# EAGLE design n2k-breakout-7.0-ISO (EAGLE 9.6.2)

## Sheet 1 of 5
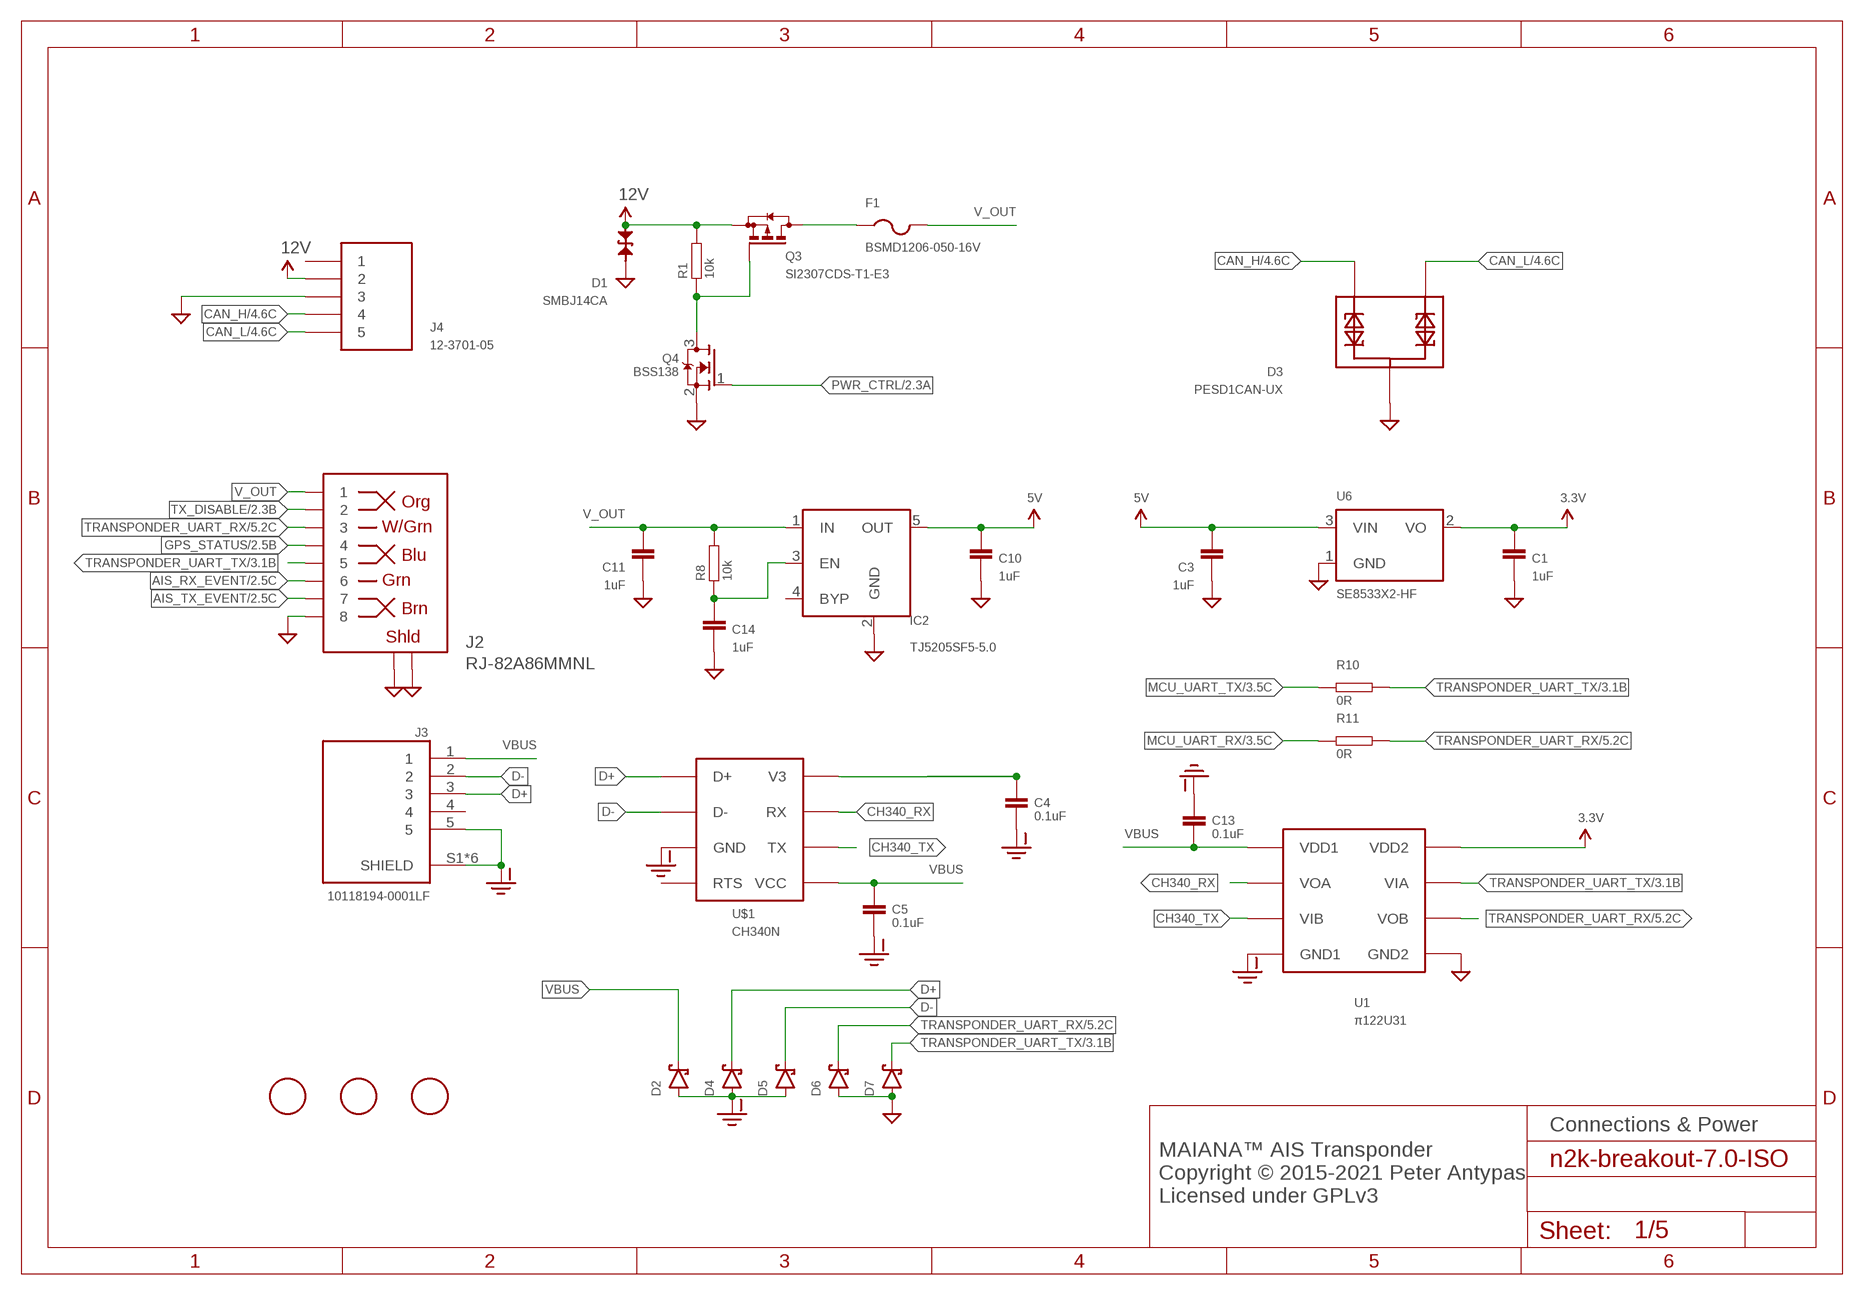
[diagram p0: schematic, sheet 1]

### Parts
C1  1uF  CAPACITOR0603  [0603]
C3  1uF  CAPACITOR0603  [0603]
C4  0.1uF  CAPACITOR0603  [0603]
C5  0.1uF  CAPACITOR0603  [0603]
C10  1uF  CAPACITOR0603  [0603]
C11  1uF  CAPACITOR0603  [0603]
C13  0.1uF  CAPACITOR0603  [0603]
C14  1uF  CAPACITOR0603  [0603]
D1  SMBJ14CA  DIODE-TVS-BIDIRSMB  [SMB-BIDIR]
D2  DIODE-SCHOTTKYSOD323  [SOD323]
D3  PESD1CAN-UX  [SOT65P210X110-3N]
D4  DIODE-SCHOTTKYSOD323  [SOD323]
D5  DIODE-SCHOTTKYSOD323  [SOD323]
D6  DIODE-SCHOTTKYSOD323  [SOD323]
D7  DIODE-SCHOTTKYSOD323  [SOD323]
F1  BSMD1206-050-16V  PTCFUSE-1206  [R1206]
IC2  TJ5205SF5-5.0  MIC5219XX  [SOT23-5]
J2  RJ-82A86MMNL  [RJ-82A86MMNL]
J3  10118194-0001LF  [AMPHENOL_10118194-0001LF]
J4  12-3701-05  [MICRO_C_5PIN]
Q3  SI2307CDS-T1-E3  BSS84  [SOT23]
Q4  BSS138  MOSFET-NREFLOW  [SOT23]
R1  10k  RESISTOR0603  [0603]
R8  10k  RESISTOR0603  [0603]
R10  0R  RESISTOR0603  [0603]
R11  0R  RESISTOR0603  [0603]
U1  π122U31  PI122U3X  [SOIC8]
U6  SE8533X2-HF  MCP1799T  [SOT23]
U$1  CH340N  CH330N  [SOIC-8]
U$2  FIDUCIAL  [FIDUCIAL_1MM]
U$3  FIDUCIAL  [FIDUCIAL_1MM]
U$4  FIDUCIAL  [FIDUCIAL_1MM]

### Nets
3.3V: C1.P$1 U1.8(VDD2) U6.2(VO) ; also sheet 2,3,4,5
5V: C3.P$1 C10.P$1 IC2.5(OUT) U6.3(VIN) ; also sheet 4,5
12V: D1.A J4.2 Q3.2(S) R1.P$2 ; also sheet 2,5
AIS_RX_EVENT: J2.P$6 ; also sheet 2
AIS_TX_EVENT: J2.P$7 ; also sheet 2
CAN_H: D3.2 J4.4 ; also sheet 4,5
CAN_L: D3.1 J4.5 ; also sheet 4,5
CH340_RX: U1.2(VOA) U$1.7(RX)
CH340_TX: U1.3(VIB) U$1.6(TX)
D+: D4.C J3.3 U$1.1(D+)
D-: D5.C J3.2 U$1.2(D-)
GND: C1.P$2 C3.P$2 C10.P$2 C11.P$2 C14.P$2 D1.C D3.3 D6.A D7.A IC2.2(GND) J2.P$8 J2.P$9(SHLD) J2.P$10(SHLD) J2.P$11(SHLD) J2.P$12(SHLD) J4.3 Q4.2(S) U1.5(GND2) U6.1(GND) ; also sheet 2,3,4,5
GND-ISO: C4.P$2 C5.P$2 C13.P$1 D2.A D4.A D5.A J3.5 J3.S1(SHIELD) J3.S2(SHIELD) J3.S3(SHIELD) J3.S4(SHIELD) J3.S5(SHIELD) J3.S6(SHIELD) U1.4(GND1) U$1.3(GND)
GPS_STATUS: J2.P$4 ; also sheet 2
MCU_UART_RX: R11.P$1 ; also sheet 3
MCU_UART_TX: R10.P$1 ; also sheet 3
N$1: C4.P$1 U$1.8(V3)
N$8: Q3.1(G) Q4.3(D) R1.P$1
N$10: F1.1 Q3.3(D)
N$12: C14.P$1 IC2.3(EN) R8.P$1
PWR_CTRL: Q4.1(G) ; also sheet 2
TRANSPONDER_UART_RX: D6.C J2.P$3 R11.P$2 U1.6(VOB) ; also sheet 5
TRANSPONDER_UART_TX: D7.C J2.P$5 R10.P$2 U1.7(VIA) ; also sheet 3,5
TX_DISABLE: J2.P$2 ; also sheet 2,3
V_OUT: C11.P$1 F1.2 IC2.1(IN) J2.P$1 R8.P$2
VBUS: C5.P$1 C13.P$2 D2.C J3.1 U1.1(VDD1) U$1.5(VCC)
Unconnected: IC2.4(BYP) J3.4 J4.1 U$1.4(RTS)

### Notes on the sheet
- Connections & Power
- MAIANA™ AIS Transponder
  Copyright © 2015-2021 Peter Antypas
  Licensed under GPLv3

## Sheet 2 of 5
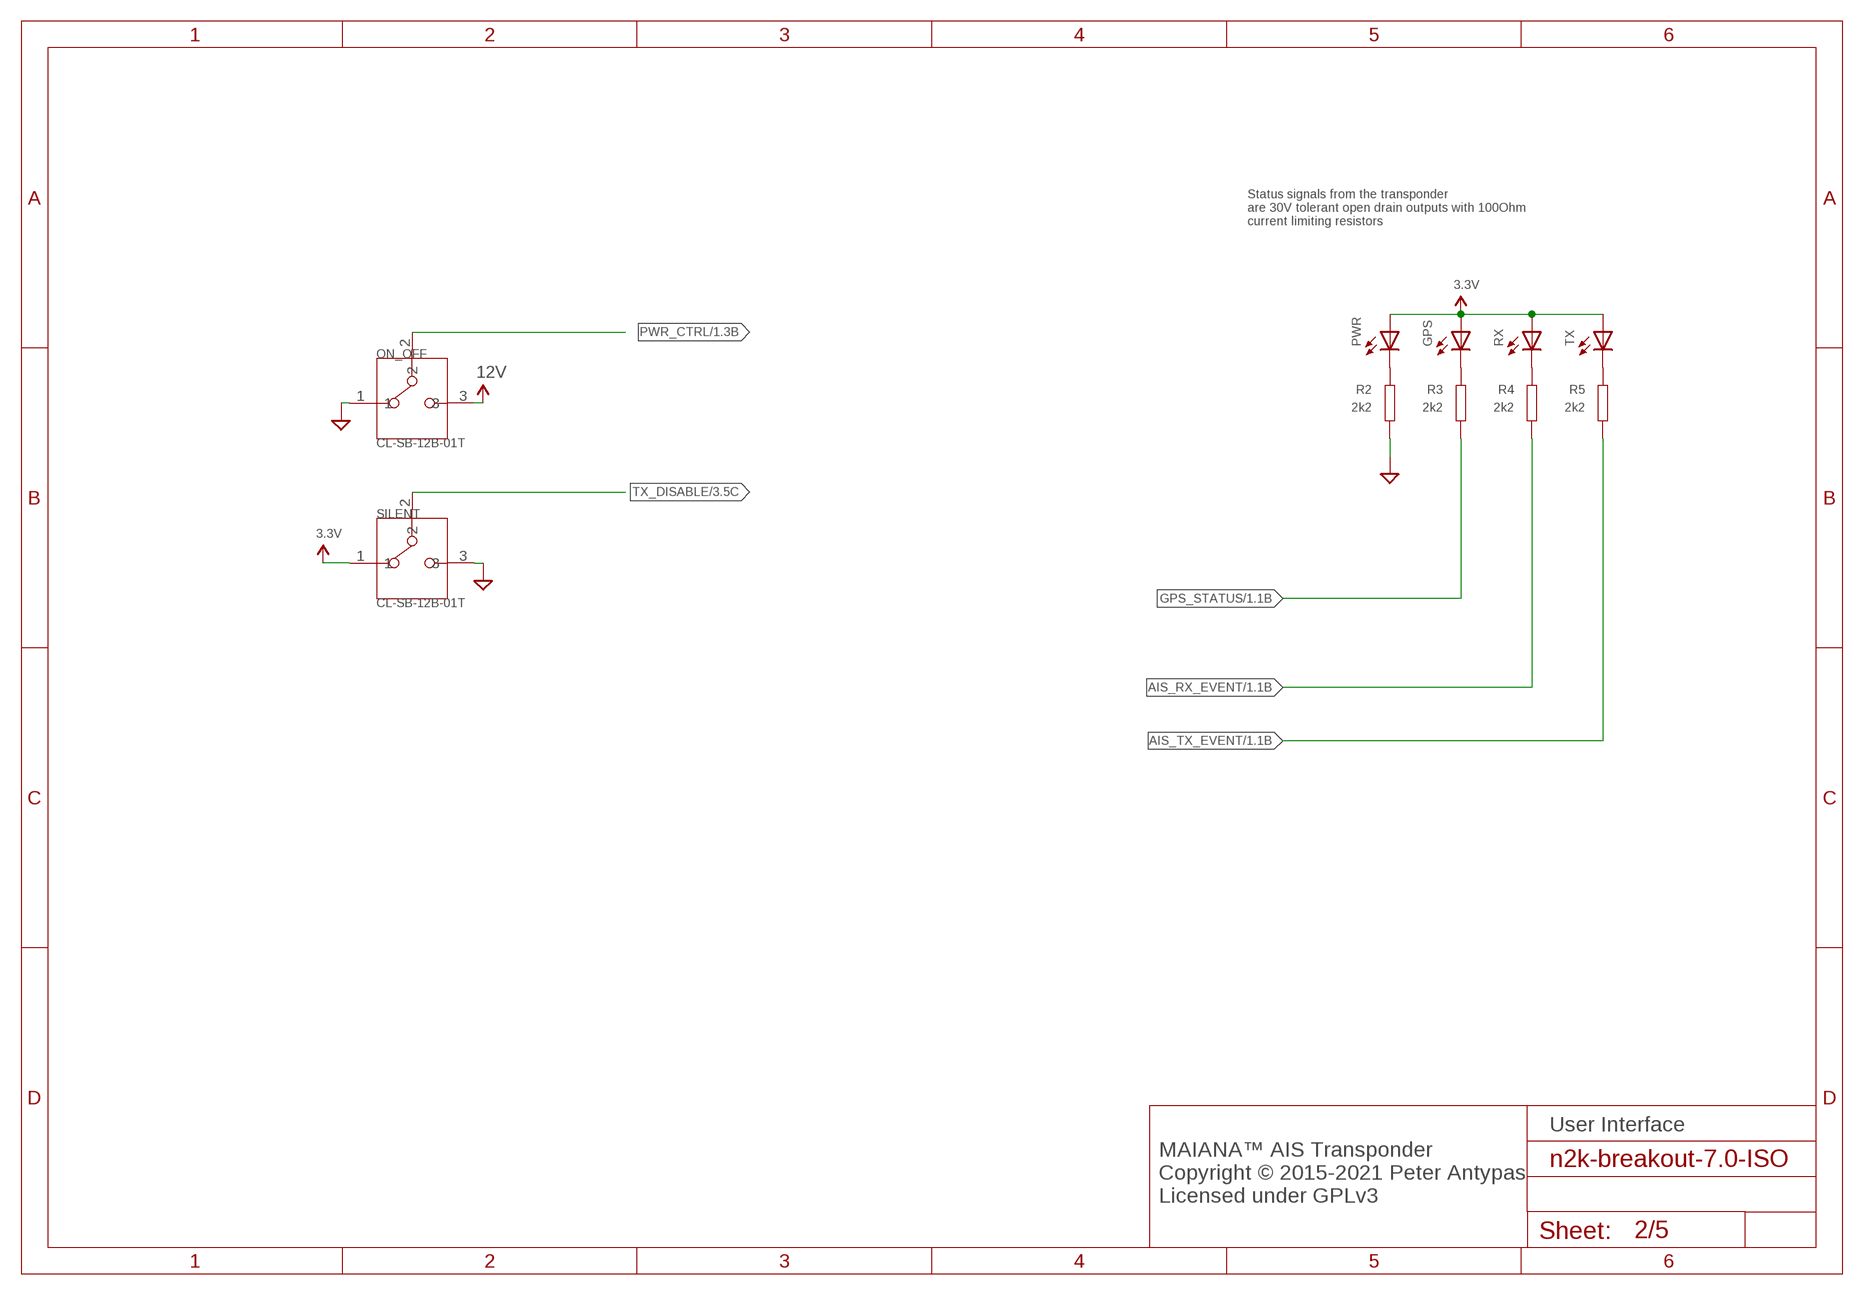
[diagram p1: schematic, sheet 2]

### Parts
GPS  LEDCHIPLED_1206  [CHIPLED_1206]
ON_OFF  CL-SB-12B-01T  [CL-SB-12B]
PWR  LEDCHIPLED_1206  [CHIPLED_1206]
R2  2k2  RESISTOR0603  [0603]
R3  2k2  RESISTOR0603  [0603]
R4  2k2  RESISTOR0603  [0603]
R5  2k2  RESISTOR0603  [0603]
RX  LEDCHIPLED_1206  [CHIPLED_1206]
SILENT  CL-SB-12B-01T  [CL-SB-12B]
TX  LEDCHIPLED_1206  [CHIPLED_1206]

### Nets
3.3V: GPS.A PWR.A RX.A SILENT.1 TX.A ; also sheet 1,3,4,5
12V: ON_OFF.3 ; also sheet 1,5
AIS_RX_EVENT: R4.P$2 ; also sheet 1
AIS_TX_EVENT: R5.P$2 ; also sheet 1
GND: ON_OFF.1 R2.P$2 SILENT.3 ; also sheet 1,3,4,5
GPS_STATUS: R3.P$2 ; also sheet 1
N$2: PWR.C R2.P$1
N$3: GPS.C R3.P$1
N$4: R4.P$1 RX.C
N$6: R5.P$1 TX.C
PWR_CTRL: ON_OFF.2 ; also sheet 1
TX_DISABLE: SILENT.2 ; also sheet 1,3

### Notes on the sheet
- Status signals from the transponder
  are 30V tolerant open drain outputs with 100Ohm 
  current limiting resistors
- User Interface
- MAIANA™ AIS Transponder
  Copyright © 2015-2021 Peter Antypas
  Licensed under GPLv3

## Sheet 3 of 5
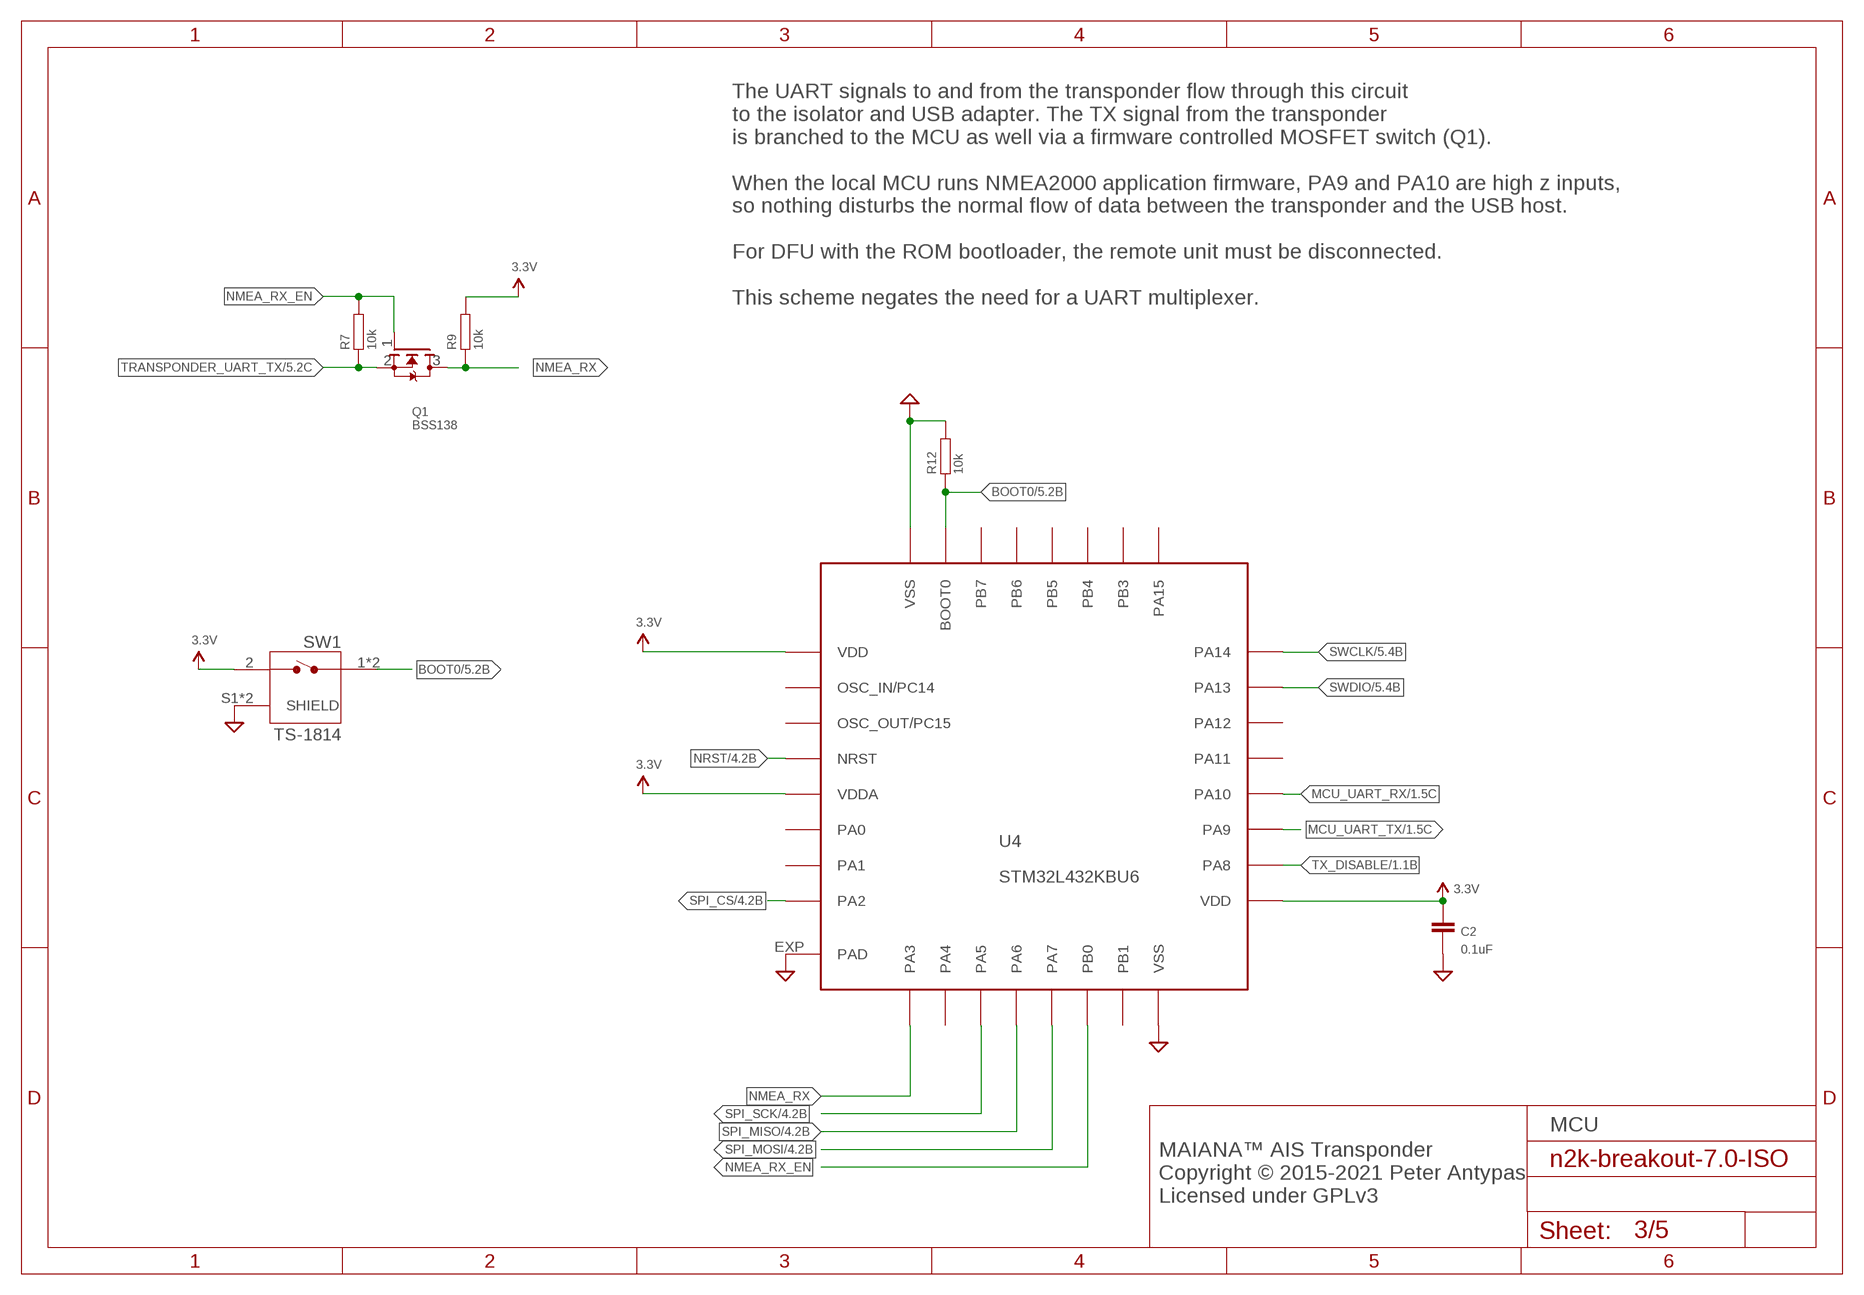
[diagram p2: schematic, sheet 3]

### Parts
C2  0.1uF  CAPACITOR0603  [0603]
Q1  BSS138  MOSFET-NREFLOW  [SOT23]
R7  10k  RESISTOR0603  [0603]
R9  10k  RESISTOR0603  [0603]
R12  10k  RESISTOR0603  [0603]
SW1  TS-1814  1977066-1  [TE_1977066-1]
U4  STM32L432KBU6  STM32L432KXXX  [QFN32]

### Nets
3.3V: C2.P$1 R9.P$2 SW1.2 U4.1(VDD) U4.5(VDDA) U4.17(VDD) ; also sheet 1,2,4,5
BOOT0: R12.P$1 SW1.1 SW1.3 U4.31(BOOT0) ; also sheet 5
GND: C2.P$2 R12.P$2 SW1.S1(SHIELD) SW1.S2(SHIELD) U4.16(VSS) U4.32(VSS) U4.EXP(PAD) ; also sheet 1,2,4,5
MCU_UART_RX: U4.20(PA10) ; also sheet 1
MCU_UART_TX: U4.19(PA9) ; also sheet 1
NMEA_RX: Q1.3(D) R9.P$1 U4.9(PA3)
NMEA_RX_EN: Q1.1(G) R7.P$2 U4.14(PB0)
NRST: U4.4(NRST) ; also sheet 4,5
SPI_CS: U4.8(PA2) ; also sheet 4
SPI_MISO: U4.12(PA6) ; also sheet 4
SPI_MOSI: U4.13(PA7) ; also sheet 4
SPI_SCK: U4.11(PA5) ; also sheet 4
SWCLK: U4.24(PA14) ; also sheet 5
SWDIO: U4.23(PA13) ; also sheet 5
TRANSPONDER_UART_TX: Q1.2(S) R7.P$1 ; also sheet 1,5
TX_DISABLE: U4.18(PA8) ; also sheet 1,2
Unconnected: U4.2(OSC_IN/PC14) U4.3(OSC_OUT/PC15) U4.6(PA0) U4.7(PA1) U4.10(PA4) U4.15(PB1) U4.21(PA11) U4.22(PA12) U4.25(PA15) U4.26(PB3) U4.27(PB4) U4.28(PB5) U4.29(PB6) U4.30(PB7)

### Notes on the sheet
- The UART signals to and from the transponder flow through this circuit
  to the isolator and USB adapter. The TX signal from the transponder
  is branched to the MCU as well via a firmware controlled MOSFET switch (Q1).
  
  When the local MCU runs NMEA2000 application firmware, PA9 and PA10 are high z inputs,
  so nothing disturbs the normal flow of data between the transponder and the USB host.
  
  For DFU with the ROM bootloader, the remote unit must be disconnected.
  
  This scheme negates the need for a UART multiplexer.
- MCU
- MAIANA™ AIS Transponder
  Copyright © 2015-2021 Peter Antypas
  Licensed under GPLv3

## Sheet 4 of 5
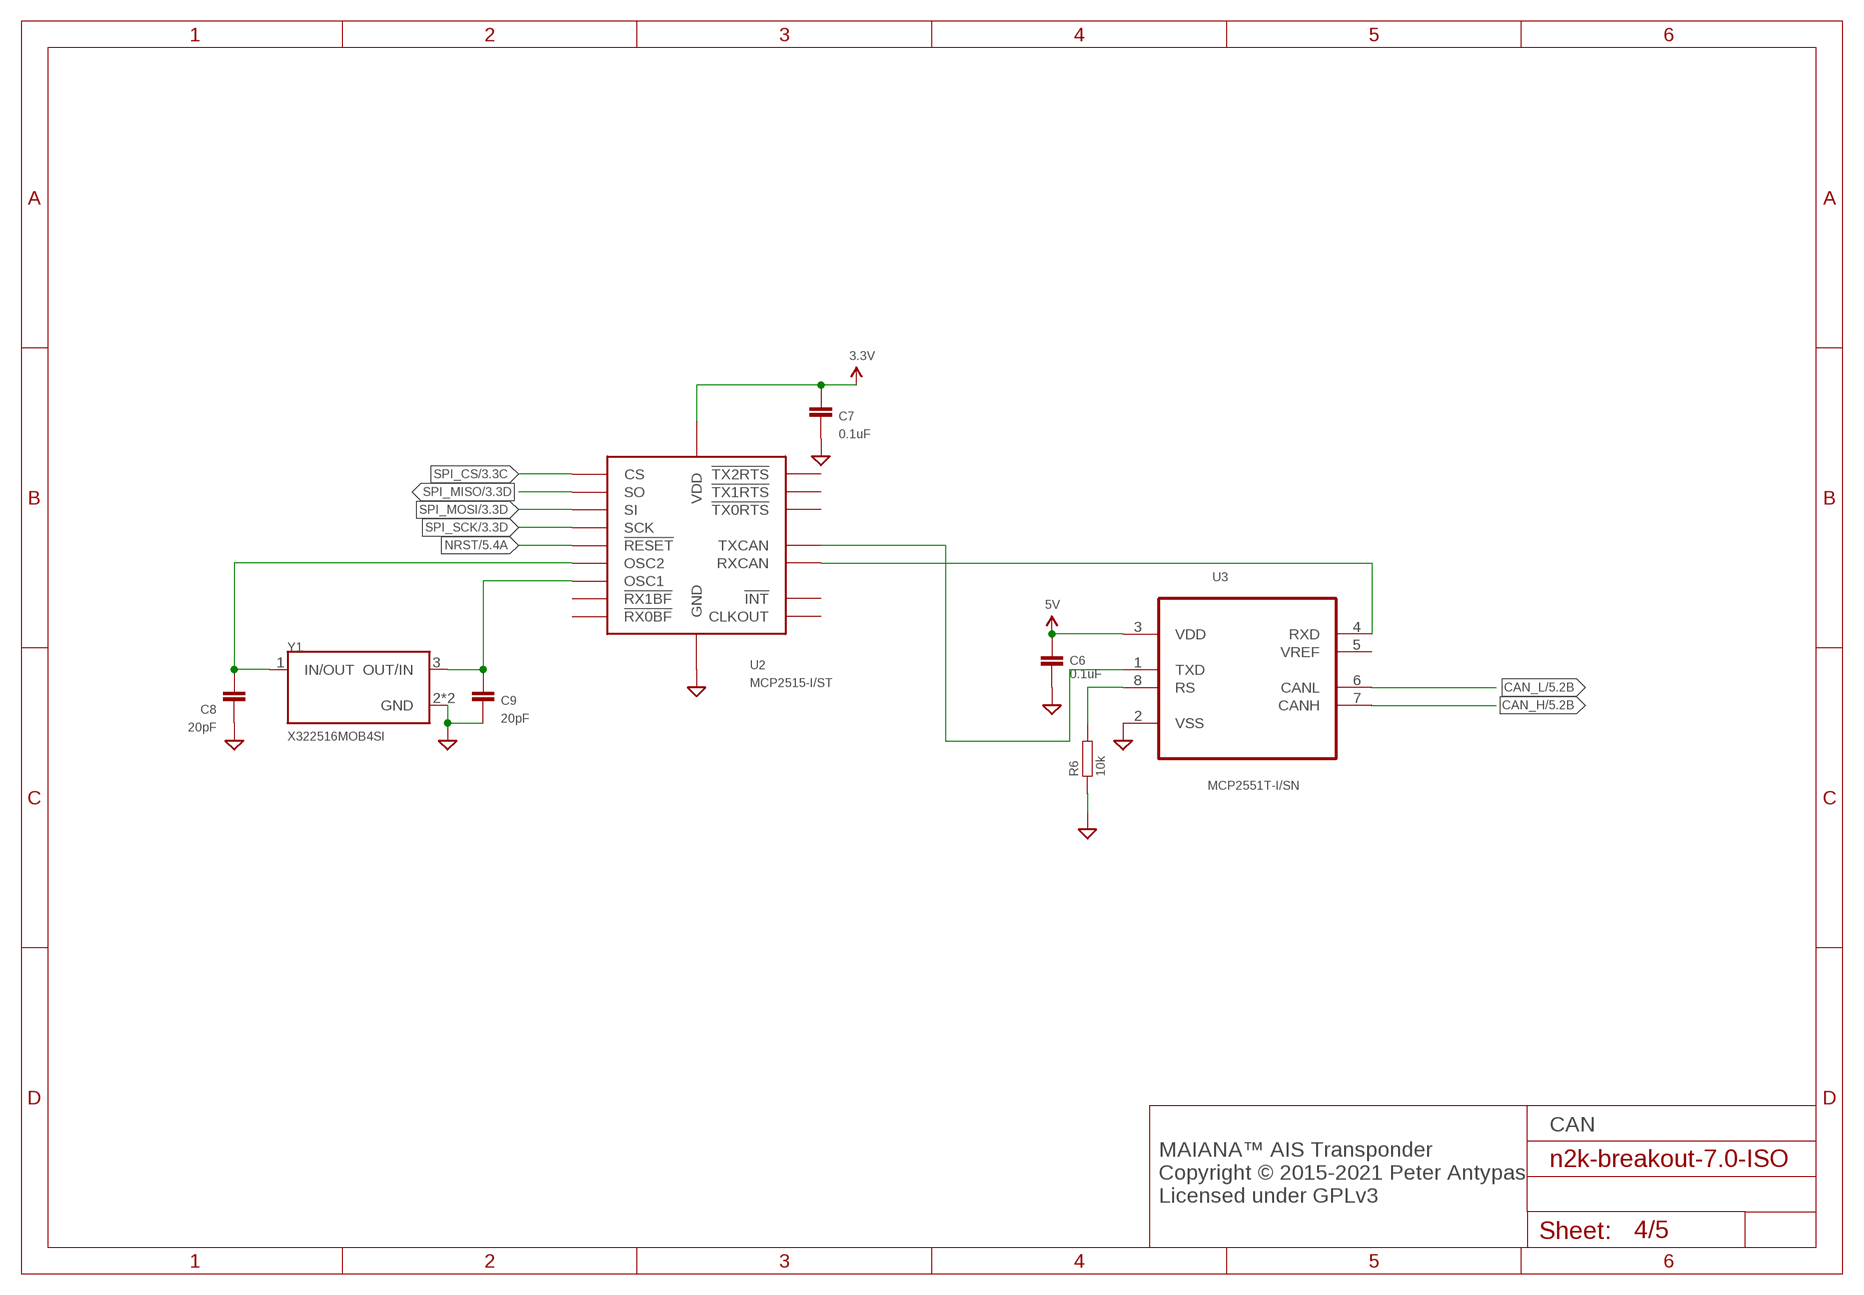
[diagram p3: schematic, sheet 4]

### Parts
C6  0.1uF  CAPACITOR0603  [0603]
C7  0.1uF  CAPACITOR0603  [0603]
C8  20pF  CAPACITOR0603  [0603]
C9  20pF  CAPACITOR0603  [0603]
R6  10k  RESISTOR0603  [0603]
U2  MCP2515-I/ST  MCP2515TSSOP20  [TSSOP20]
U3  MCP2551T-I/SN  [SOIC127P600X175-8N]
Y1  X322516MOB4SI  ECS-300-8-36CKM-TR  [XTAL_ECS-160-10-36-JGN-TR]

### Nets
3.3V: C7.P$1 U2.20(VDD) ; also sheet 1,2,3,5
5V: C6.P$1 U3.3(VDD) ; also sheet 1,5
CAN_H: U3.7(CANH) ; also sheet 1,5
CAN_L: U3.6(CANL) ; also sheet 1,5
GND: C6.P$2 C7.P$2 C8.P$2 C9.P$2 R6.P$1 U2.10(GND) U3.2(VSS) Y1.2(GND) Y1.4(GND) ; also sheet 1,2,3,5
N$5: R6.P$2 U3.8(RS)
N$7: U2.2(RXCAN) U3.4(RXD)
N$11: U2.1(TXCAN) U3.1(TXD)
N$14: C9.P$1 U2.9(OSC1) Y1.3(OUT/IN)
N$16: C8.P$1 U2.8(OSC2) Y1.1(IN/OUT)
NRST: U2.19(!RESET) ; also sheet 3,5
SPI_CS: U2.18(CS) ; also sheet 3
SPI_MISO: U2.17(SO) ; also sheet 3
SPI_MOSI: U2.16(SI) ; also sheet 3
SPI_SCK: U2.14(SCK) ; also sheet 3
Unconnected: U2.3(CLKOUT) U2.4(!TX0RTS) U2.5(!TX1RTS) U2.7(!TX2RTS) U2.11(!RX1BF) U2.12(!RX0BF) U2.13(!INT) U3.5(VREF)

### Notes on the sheet
- CAN
- MAIANA™ AIS Transponder
  Copyright © 2015-2021 Peter Antypas
  Licensed under GPLv3

## Sheet 5 of 5
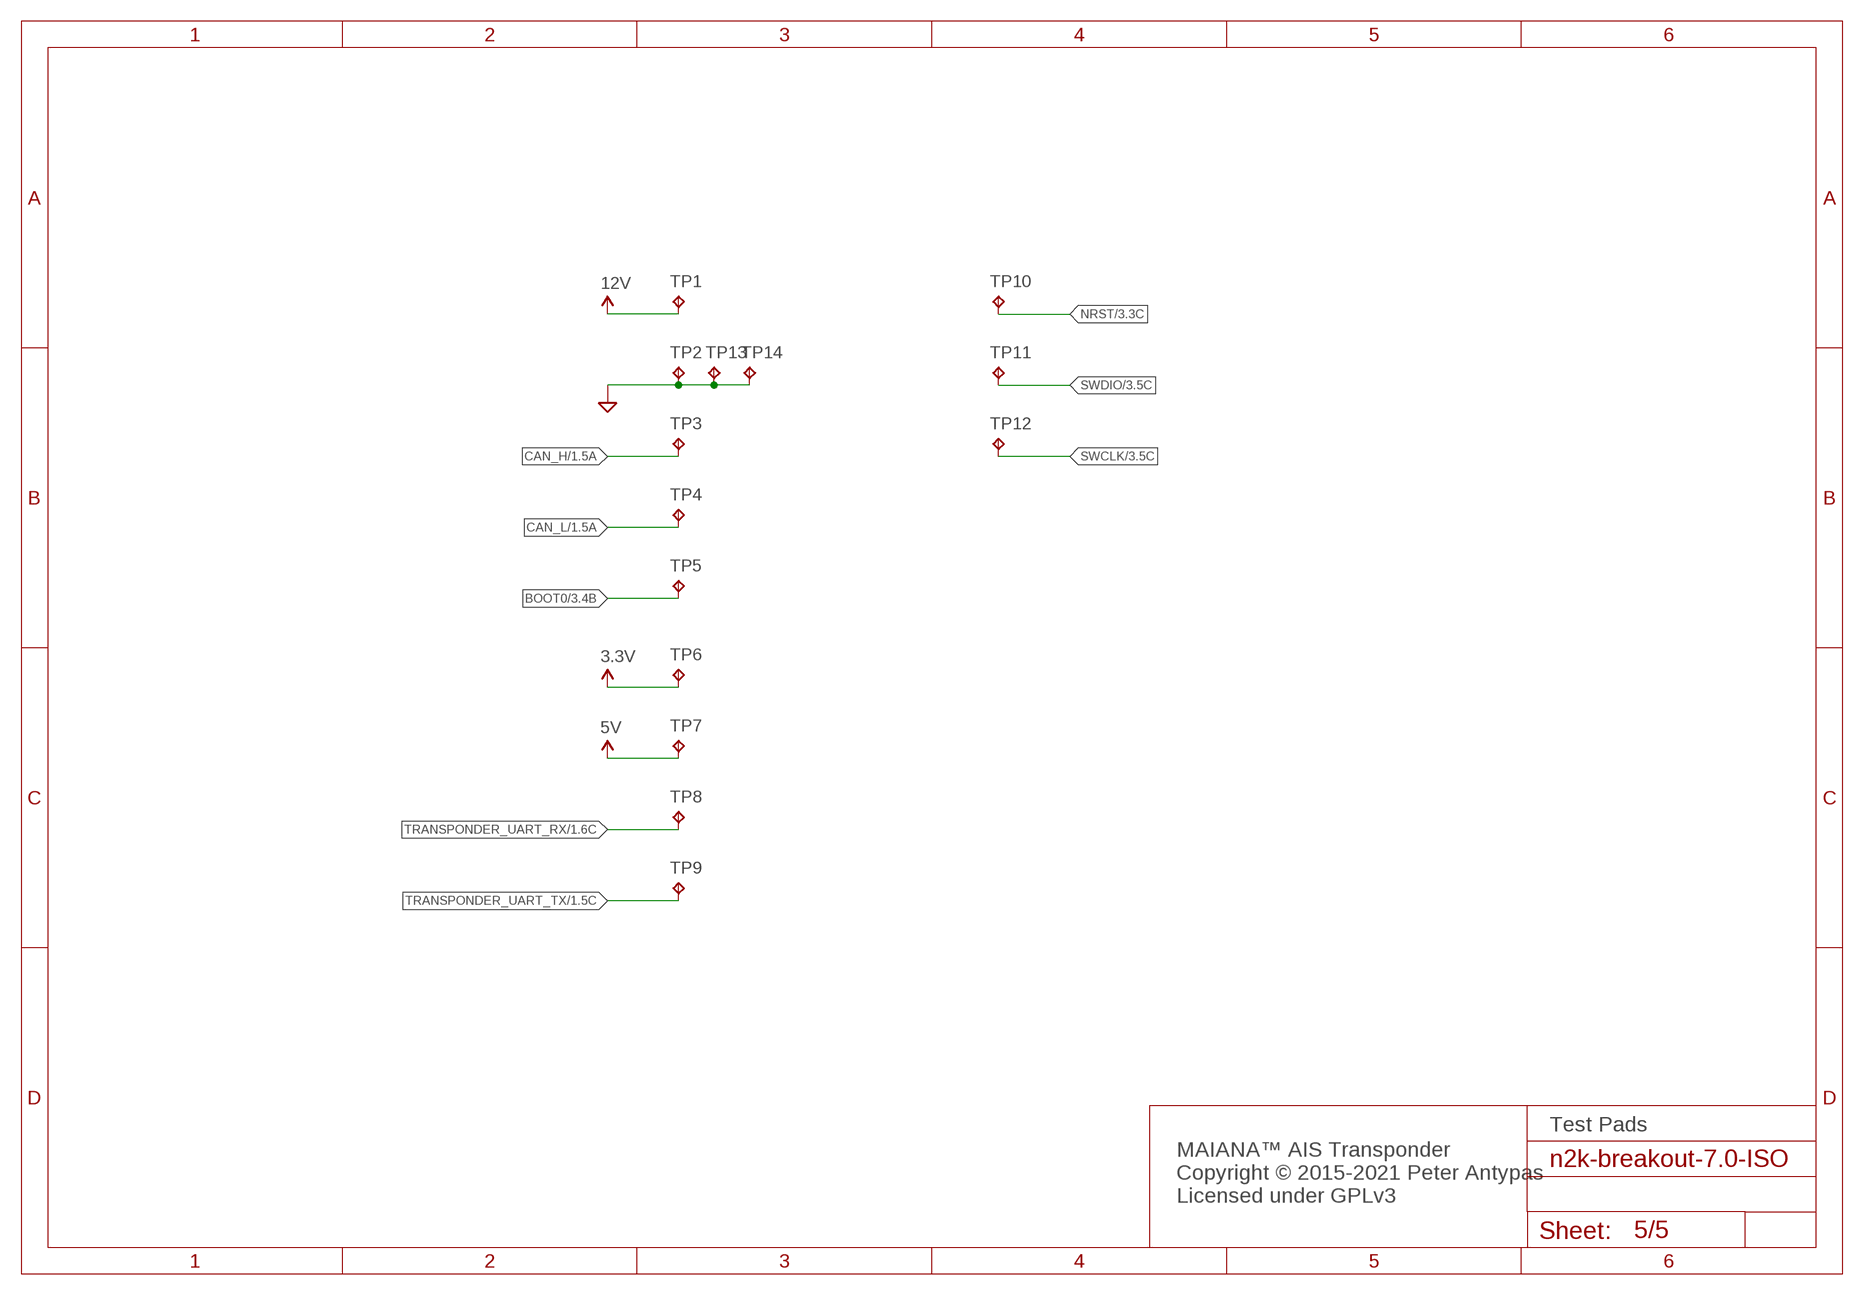
[diagram p4: schematic, sheet 5]

### Parts
TP1  TPTP12R  [TP12R]
TP2  TPTP12R  [TP12R]
TP3  TPTP12R  [TP12R]
TP4  TPTP12R  [TP12R]
TP5  TPTP12R  [TP12R]
TP6  TPTP12R  [TP12R]
TP7  TPTP12R  [TP12R]
TP8  TPTP12R  [TP12R]
TP9  TPTP12R  [TP12R]
TP10  TPTP12R  [TP12R]
TP11  TPTP12R  [TP12R]
TP12  TPTP12R  [TP12R]
TP13  TPTP12R  [TP12R]
TP14  TPTP12R  [TP12R]

### Nets
3.3V: TP6.TP ; also sheet 1,2,3,4
5V: TP7.TP ; also sheet 1,4
12V: TP1.TP ; also sheet 1,2
BOOT0: TP5.TP ; also sheet 3
CAN_H: TP3.TP ; also sheet 1,4
CAN_L: TP4.TP ; also sheet 1,4
GND: TP2.TP TP13.TP TP14.TP ; also sheet 1,2,3,4
NRST: TP10.TP ; also sheet 3,4
SWCLK: TP12.TP ; also sheet 3
SWDIO: TP11.TP ; also sheet 3
TRANSPONDER_UART_RX: TP8.TP ; also sheet 1
TRANSPONDER_UART_TX: TP9.TP ; also sheet 1,3

### Notes on the sheet
- Test Pads
- MAIANA™ AIS Transponder
  Copyright © 2015-2021 Peter Antypas
  Licensed under GPLv3

## Library data of the parts
C1 C3 C10 C11 C14 = MyPassives:CAPACITOR: Standard SMD capacitor; PARTNO: CC0603KRX5R8BB105
C2 C4-C7 C13 = MyPassives:CAPACITOR: Standard SMD capacitor; PARTNO: 06035C104KAT2A
C8 C9 = MyPassives:CAPACITOR: Standard SMD capacitor; PARTNO: GRM1885C1H200JA01D
D1 = MyDiodes:DIODE-TVS-BIDIR: Bidirectional TVS diode; PARTNO: SMBJ14CA
D2 D4-D7 = MyDiodes:DIODE-SCHOTTKY: Standard SMD Schottky diode
D3 = PESD1CAN-UX:PESD1CAN-UX: Bidirectional TVS Diode for CAN bus; PARTNO: PESD1CAN-UX
F1 = adafruit:PTCFUSE: PTC fuses, resettable thermistors; PARTNO: BSMD1206-050-16V
GPS PWR RX TX = led:LED: LED OSRAM: - CHIPLED LG R971, LG N971, LY N971, LG Q971, LY Q971, LO R971, LY R971 LH N974, LH R974 LS Q976, LO Q976, LY Q976 LO Q996 - Hyper CHIPLED LW Q18S LB Q993, LB Q99A, LB R99A - SideLED LS A670, LO A670, LY A670, LG A670, LP A670 LB A673, LV A673, LT A673, LW A673 LH A674 LY A675 LS A676, LA A676, LO A676, LY A676, LW A676 LS A679, LY A679, LG A679 - Hyper Micro SIDELED® LS Y876, LA Y876, LO Y876, LY Y876 LT Y87S - SmartLED LW L88C, LW L88S LB L89C, LB L89S, LG L890 LS L89K, LO L89K, LY L89K LS L896, LA L896, LO L896, LY L896 - TOPLED LS T670, LO T670, LY T670, LG T670, LP T670 LSG T670, LSP T670, LSY T670, LOP T670, LYG T670 LG T671, LOG T671, LSG T671 LB T673, LV T673, LT T673, LW T673 LH T674 LS T676, LA T676, LO T676, LY T676, LB T676, LH T676, LSB T676, LW T676 LB T67C, LV T67C, LT T67C, LS T67K, LO T67K, LY T67K, LW E67C LS E67B, LA E67B, LO E67B, LY E67B, LB E67C, LV E67C, LT E67C LW T67C LS T679, LY T679, LG T679 LS T770, LO T770, LY T770, LG T770, LP T770 LB T773, LV T773, LT T773, LW T773 LH T774 LS E675, LA E675, LY E675, LS T675 LS T776, LA T776, LO T776, LY T776, LB T776 LHGB T686 LT T68C, LB T68C - Hyper Mini TOPLED® LB M676 - Mini TOPLED Santana® LG M470 LS M47K, LO M47K, LY M47K Source: http://www.osram.convergy.de LUXEON: - LUMILED® LXK2-PW12-R00, LXK2-PW12-S00, LXK2-PW14-U00, LXK2-PW14-V00 LXK2-PM12-R00, LXK2-PM12-S00, LXK2-PM14-U00 LXK2-PE12-Q00, LXK2-PE12-R00, LXK2-PE12-S00, LXK2-PE14-T00, LXK2-PE14-U00 LXK2-PB12-K00, LXK2-PB12-L00, LXK2-PB12-M00, LXK2-PB14-N00, LXK2-PB14-P00, LXK2-PB14-Q00 LXK2-PR12-L00, LXK2-PR12-M00, LXK2-PR14-Q00, LXK2-PR14-R00 LXK2-PD12-Q00, LXK2-PD12-R00, LXK2-PD12-S00 LXK2-PH12-R00, LXK2-PH12-S00 LXK2-PL12-P00, LXK2-PL12-Q00, LXK2-PL12-R00 Source: www.luxeon.com KINGBRIGHT: KA-3528ASYC Source: www.kingbright.com; PARTNO: TJ-S3216CL9T5ALC2G-A5
IC2 = v-reg-micrel:MIC5219XX: VOLTAGE REGULATOR; OC_FARNELL: unknown; OC_NEWARK: unknown; PARTNO: TJ5205SF5-5.0
J2 = xyfw:RJ-82A86MMNL: Mid-mount RJ45 jack; PARTNO: RJ-82A86MMNL
J3 = 10118194-0001LF:10118194-0001LF: Micro Usb, 2.0 Type b, Rcpt, Smt Check prices <https://snapeda.com/parts/10118194-0001LF/Amphenol%20ICC%20%28FCI%29/view-part/?ref=eda>; ARROW_ELECTRONICS-PURCHASE-URL: https://snapeda.com/shop?store=Arrow+Electronics&id=4816633; AVAILABILITY: Good; DESCRIPTION: USB - micro B USB 2.0 Receptacle Connector 5 Position Surface Mount, Right Angle; Through Hole; DIGIKEY-PURCHASE-URL: https://snapeda.com/shop?store=DigiKey&id=4816633; MF: Amphenol ICC (FCI); MOUSER-PURCHASE-URL: https://snapeda.com/shop?store=Mouser&id=4816633; MP: 10118194-0001LF; PACKAGE: None; PARTNO: 10118194-0001LF; PRICE: None
J4 = Hysik:12-3701-05: Micro-C NMEA 2000 connector, 5pin, male, 90deg PCB mount; PARTNO: 12-3701-05
ON_OFF SILENT = CL-SB-12B-01T:CL-SB-12B-01T: Check prices <https://pricing.snapeda.com/parts/CL-SB-12B-01T/Nidec%20Copal/view-part?ref=eda>; AVAILABILITY: In Stock; DESCRIPTION: Slide Switch SPDT Surface Mount; MF: Nidec Copal; MP: CL-SB-12B-01T; PACKAGE: None; PARTNO: CL-SB-12B-01T; PRICE: None
Q1 Q4 = adafruit:MOSFET-N: N-Channel Mosfet 2N7002E - 60V 260mA SOT23 [Digikey: 2N7002ET1GOSTR-ND] - REEL BSH103 - 30V 850mA SOT23 [Digikey: 568-5013-1-ND]; PARTNO: BSS138
Q3 = transistor-small-signal:BSS84: P-CHANNEL MOS FET; PARTNO: SI2307CDS-T1-E3
R1 R6-R9 R12 = MyPassives:RESISTOR: Standard SMD resistor; PARTNO: RC0603FR-0710KL
R2-R5 = MyPassives:RESISTOR: Standard SMD resistor; PARTNO: CR0603-FX-2201ELF
R10 R11 = MyPassives:RESISTOR: Standard SMD resistor
SW1 = 1977066-1:1977066-1: FSMMSHP=R/A TACT SWITCH, SMT W/L Check prices <https://pricing.snapeda.com/parts/1977066-1/TE%20Connectivity/view-part?ref=eda>; AVAILABILITY: Not in stock; COMMENT: 1977066-1; DESCRIPTION: Switch Tactile OFF (ON) SPST Round Button Gull Wing 0.05A 12VDC 100000Cycles 1.57N SMD T/R; MF: TE Connectivity; MP: 1977066-1; PACKAGE: None; PARTNO: TS-1814; PRICE: None; PURCHASE-URL: https://pricing.snapeda.com/search/part/1977066-1/?ref=eda
TP1-TP14 = testpad:TP: Test pad
U1 = 2paisemi:PI122U3X: 2 Channel Capacitive Divider Isolator; PARTNO: π122U31
U2 = mcp2515:MCP2515: CAN Bus Controller with SPI interface; PARTNO: MCP2515-I/ST
U3 = MCP2551T-I_SN:MCP2551T-I/SN: High-Speed CAN Transceiver Check prices <https://pricing.snapeda.com/parts/MCP2551T-I/SN/Microchip/view-part?ref=eda>; AVAILABILITY: In Stock; DESCRIPTION: 1/1 Transceiver Half CANbus 8-SOIC; MF: Microchip; MP: MCP2551T-I/SN; PACKAGE: SO-8 Microchip; PARTNO: MCP2551T-I/SN; PRICE: None; PURCHASE-URL: https://pricing.snapeda.com/search/part/MCP2551T-I/SN/?ref=eda
U4 = stm32:STM32L432KXXX; PARTNO: STM32L422KBU6
U6 = microchip:MCP1799T: 80mA High Voltage Automotive LDO; PARTNO: SE8533X2-HF; VALUE: MCP1799T
U$1 = JiangsuQinHeng:CH330N: USB to UART bridge; PARTNO: CH340N
U$2-U$4 = adafruit:FIDUCIAL: For use by pick and place machines to calibrate the vision/machine, 1mm By microbuilder.eu
Y1 = ECS-300-8-36CKM-TR:ECS-300-8-36CKM-TR: The minature ECS-160-10-36-JGN-TR is a compact SMD Crystal. The industry standard 2.5 x 2.0 x 0.55 mm ceramic package is ideal for today’s SMD manufacturing environment. Buy Part <https://snapeda.com/parts/ECS-300-8-36CKM-TR/ECS%20Inc./view-part/?ref=eda>; ARROW_ELECTRONICS-PURCHASE-URL: https://snapeda.com/shop?store=Arrow+Electronics&id=576184; AVAILABILITY: Good; DESCRIPTION: 30MHz ±10ppm Crystal 8pF 50 Ohms 4-SMD, No Lead; DIGIKEY-PURCHASE-URL: https://snapeda.com/shop?store=DigiKey&id=576184; MF: ECS Inc.; MOUSER-PURCHASE-URL: https://snapeda.com/shop?store=Mouser&id=576184; MP: ECS-300-8-36CKM-TR; PACKAGE: SMD-4 ECS International; PARTNO: X322516MOB4SI; PRICE: None

## Board
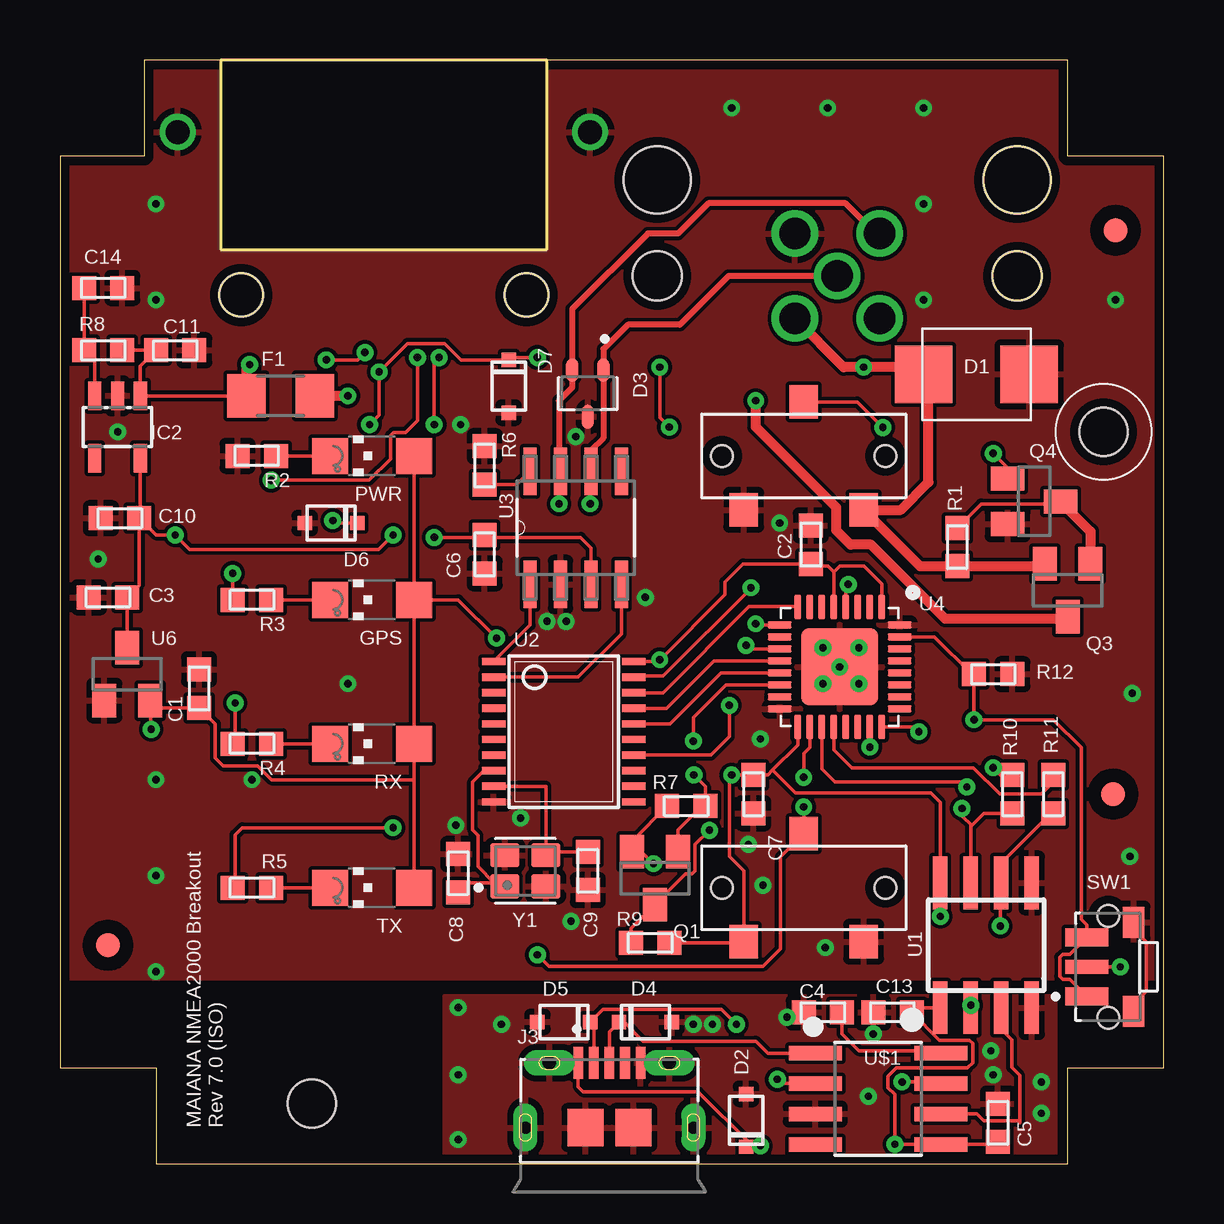
[diagram p5: board, top side]
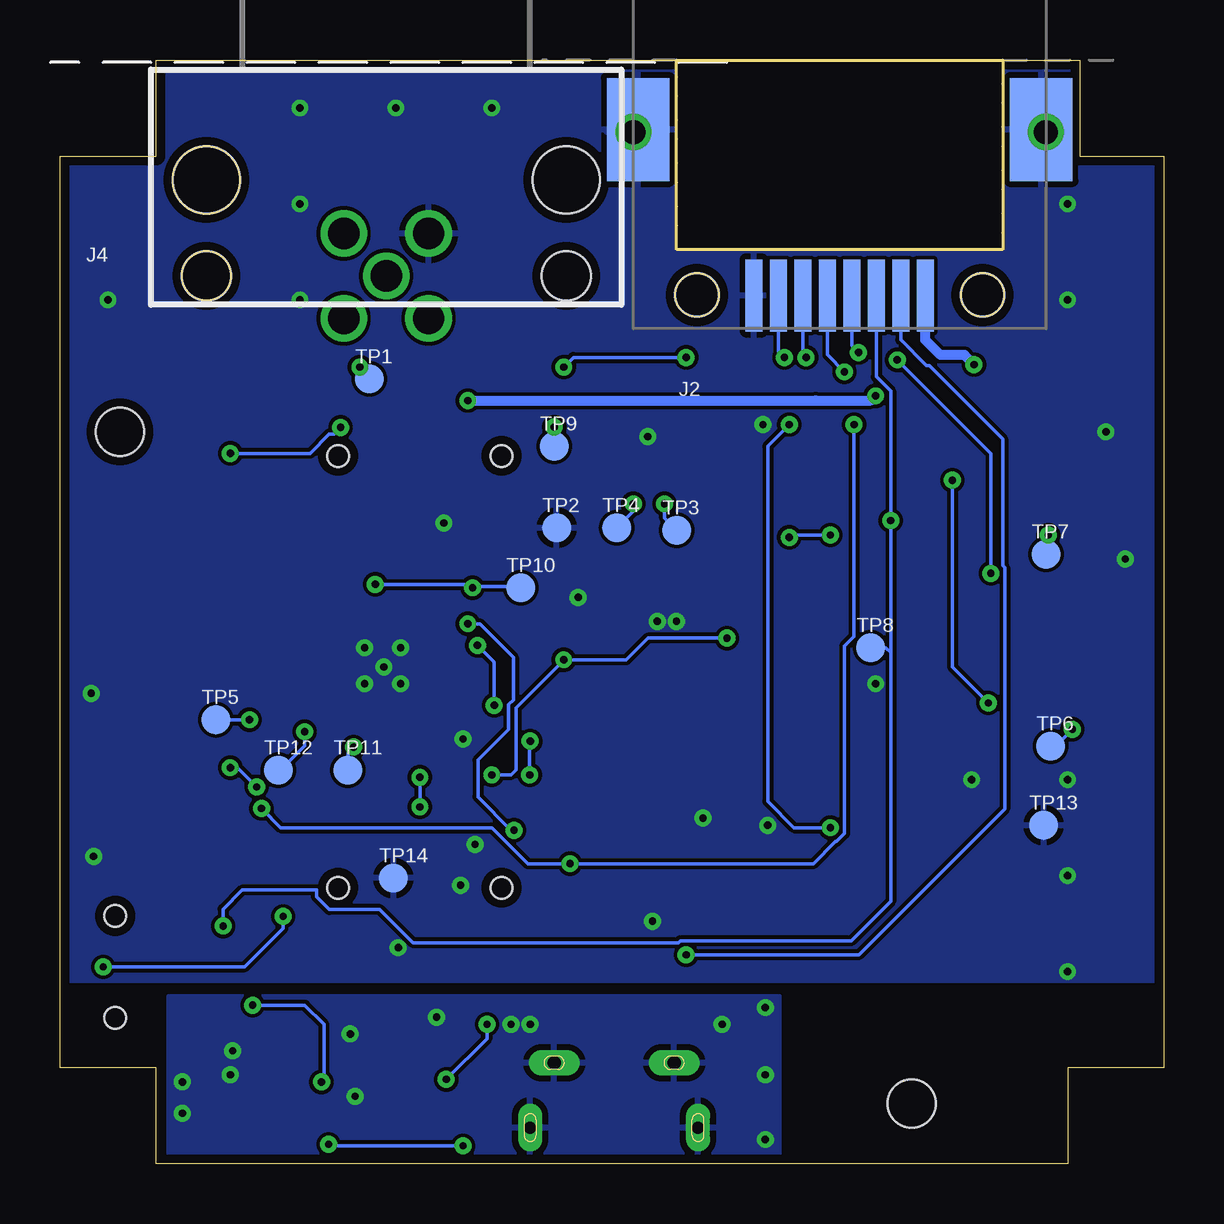
[diagram p6: board, bottom side, seen from below]

Size 46 x 46 mm. Coordinates in mm from the lower left corner, seen from the top.
Outline: 0,4 4,4 4,0 42,0 42,4 46,4 46,42 42,42 42,46 3.5,46 3.5,42 0,42 0,4
Copper layers (1*16): Top 0.035mm / dielectric 1.5mm / Bottom 0.035mm
Design rules "default *": minimum track width 6mil, minimum drill 0.3mm, track to track 6mil, track to pad 6mil, pad to pad 6mil, via to via 6mil, smd to smd 0mil, copper to edge 15mil, drill to drill 6mil, minimum pad ring 10mil, minimum via ring 8mil, stop-mask expansion 0mil, vias tented up to drill 20mil, thermal gap 10mil
Holes 2 mm at 43.5,30.5 10.5,2.5

### Footprints (pad centres in the part's own frame; a part is rotated, then mirrored left to right if it is on the bottom)
0603 = smd 1 x 1: P$1 -0.8,0; P$2 0.8,0
SMB-BIDIR = smd 2.4 x 2.4: A 2.2,0; C -2.2,0
SOD323 = smd 0.6 x 0.6: A 1.1,0; C -1.1,0
SOT65P210X110-3N = smd 0.99 x 0.5: 1 -0.97,0.65; 2 -0.97,-0.65; 3 0.97,0
R1206 = smd 1.6 x 1.803: 1 -1.422,0; 2 1.422,0
CHIPLED_1206 = smd 1.5 x 1.5: A 0,-1.75; C 0,1.75
SOT23-5 = smd 0.55 x 1.2: 1 -0.95,-1.3; 2 0,-1.3; 3 0.95,-1.3; 4 0.95,1.3; 5 -0.95,1.3
RJ-82A86MMNL = smd 0.7 x 3: P$1 -3.57,3.82; P$2 -2.55,3.82; P$3 -1.53,3.82; P$4 -0.51,3.82; P$5 0.51,3.82; P$6 1.53,3.82; P$7 2.55,3.82; P$8 3.57,3.82 | smd 2.6 x 4.3: P$9 -8.4,-3.1; P$10 8.4,-3.1 | drill 1: P$11 -8.6,-3; P$12 8.6,-3 | hole 1.8: -5.95,3.8; 5.95,3.8
AMPHENOL_10118194-0001LF = smd 0.4 x 1.35: 1 -1.3,2.7; 2 -0.65,2.7; 3 0,2.7; 4 0.65,2.7; 5 1.3,2.7 | drill 0.55 pad 0.65 long: S1 -2.5,2.7; S2 2.5,2.7 | drill 0.5 pad 0.775 long: S3 -3.5,0; S6 3.5,0 | smd 1.5 x 1.55: S4 -1,0; S5 1,0
MICRO_C_5PIN = drill 1.3: 1 1.77,1.77; 2 -1.77,1.77; 3 -1.77,-1.77; 4 1.77,-1.77; 5 0,0 | hole 2.05: -7.5,0; 7.5,0 | hole 2.8: 7.5,-4; -7.5,-4
CL-SB-12B = smd 1.2 x 1.4: 1 -2.5,-2.25; 2 0,2.25; 3 2.5,-2.25 | hole 0.9: 3.4,0; -3.4,0
SOT23 = smd 1 x 1.4: 1 -0.95,-1.1; 2 0.95,-1.1; 3 0,1.1
TE_1977066-1 = smd 0.75 x 1.8: 1 -1.225,0.9; 3 1.225,0.9 | smd 0.6 x 1.8: 2 0,0.9 | smd 1.3 x 0.9: S1 -1.85,-1.05; S2 1.85,-1.05 | hole 0.9: -2.125,0; 2.125,0
TP12R = smd 1.2 x 1.2: TP 0,0
SOIC8 = smd 0.6 x 2.2: 1 -1.905,-2.6; 2 -0.635,-2.6; 3 0.635,-2.6; 4 1.905,-2.6; 5 1.905,2.6; 6 0.635,2.6; 7 -0.635,2.6; 8 -1.905,2.6
TSSOP20 = smd 0.305 x 0.991: 1 -2.925,-2.918; 2 -2.275,-2.918; 3 -1.625,-2.918; 4 -0.975,-2.918; 5 -0.325,-2.918; 6 0.325,-2.918; 7 0.975,-2.918; 8 1.625,-2.918; 9 2.275,-2.918; 10 2.925,-2.918; 11 2.925,2.918; 12 2.275,2.918; 13 1.625,2.918; 14 0.975,2.918; 15 0.325,2.918; 16 -0.325,2.918; 17 -0.975,2.918; 18 -1.625,2.918; 19 -2.275,2.918; 20 -2.925,2.918
SOIC127P600X175-8N = smd 1.981 x 0.559: 1 -2.362,1.905; 2 -2.362,0.635; 3 -2.362,-0.635; 4 -2.362,-1.905; 5 2.362,-1.905; 6 2.362,-0.635; 7 2.362,0.635; 8 2.362,1.905
QFN32 = smd 1 x 0.3: 1 -2.5,1.75; 2 -2.5,1.25; 3 -2.5,0.75; 4 -2.5,0.25; 5 -2.5,-0.25; 6 -2.5,-0.75; 7 -2.5,-1.25; 8 -2.5,-1.75; 17 2.5,-1.75; 18 2.5,-1.25; 19 2.5,-0.75; 20 2.5,-0.25; 21 2.5,0.25; 22 2.5,0.75; 23 2.5,1.25; 24 2.5,1.75 | smd 0.3 x 1: 9 -1.75,-2.5; 10 -1.25,-2.5; 11 -0.75,-2.5; 12 -0.25,-2.5; 13 0.25,-2.5; 14 0.75,-2.5; 15 1.25,-2.5; 16 1.75,-2.5; 25 1.75,2.5; 26 1.25,2.5; 27 0.75,2.5; 28 0.25,2.5; 29 -0.25,2.5; 30 -0.75,2.5; 31 -1.25,2.5; 32 -1.75,2.5 | smd 3.2 x 3.2: EXP 0,0
SOIC-8 = smd 2.21 x 0.61: 1 -2.616,1.905; 2 -2.616,0.635; 3 -2.616,-0.635; 4 -2.616,-1.905; 5 2.616,-1.905; 6 2.616,-0.635; 7 2.616,0.635; 8 2.616,1.905
FIDUCIAL_1MM = smd 1 x 1: 1 0,0
XTAL_ECS-160-10-36-JGN-TR = smd 1.2 x 1: 1 -0.85,-0.65; 2 0.85,-0.65; 3 0.85,0.65; 4 -0.85,0.65

### Placement (x,y rotation side)
C1  5.8,19.8 90 top
C2  31.3,25.8 90 top
C3  2,23.6 180 top
C4  31.8,6.3 180 top
C5  39.1,1.7 90 top
C6  17.7,25.4 270 top
C7  28.9,15.4 270 top
C8  16.6,12.1 90 top
C9  22,12.2 270 top
C10  2.5,26.9 180 top
C11  4.8,33.9 0 top
C13  34.7,6.3 0 top
C14  1.8,36.5 0 top
D1  38.2,32.9 180 top
D2  28.6,1.8 90 top
D3  22,32.1 270 top
D4  24.4,5.9 0 top
D5  21,5.9 180 top
D6  11.3,26.7 180 top
D7  18.7,32.4 270 top
F1  9.2,32 180 top
GPS  13,23.5 90 top
IC2  2.4,30.7 180 top
J2  13.5,40 180 bottom
J3  22.9,1.5 0 top
J4  32.4,37 180 bottom
ON_OFF  31,29.5 0 top
PWR  13,29.5 90 top
Q1  24.8,11.9 180 top
Q3  42,23.9 180 top
Q4  40.6,27.6 270 top
R1  37.4,25.7 270 top
R2  8.2,29.5 180 top
R3  8,23.5 180 top
R4  8,17.5 180 top
R5  8,11.5 180 top
R6  17.7,29.1 270 top
R7  26.1,14.9 0 top
R8  1.8,33.9 0 top
R9  24.6,9.2 0 top
R10  39.7,15.4 270 top
R11  41.4,15.4 270 top
R12  38.9,20.4 0 top
RX  13,17.5 90 top
SILENT  31,11.5 0 top
SW1  43.7,8.2 90 top
TP1  33.1,32.7 0 bottom
TP2  25.3,26.5 0 bottom
TP3  20.3,26.4 0 bottom
TP4  22.8,26.5 0 bottom
TP5  39.5,18.5 0 bottom
TP6  4.7,17.4 0 bottom
TP7  4.9,25.4 0 bottom
TP8  12.2,21.5 0 bottom
TP9  25.4,29.9 0 bottom
TP10  26.8,24 0 bottom
TP11  34,16.4 0 bottom
TP12  36.9,16.4 0 bottom
TP13  5,14.1 0 bottom
TP14  32.1,11.9 0 bottom
TX  13,11.5 90 top
U1  38.6,9.1 0 top
U2  21,18 270 top
U3  21.5,26.5 90 top
U4  32.5,20.7 270 top
U6  2.8,20.4 0 top
U$1  34.1,2.7 0 top
U$2  2,9.1 0 top
U$3  44,38.9 0 top
U$4  43.9,15.4 0 top
Y1  19.4,12.2 0 top

### Tracks (layer width: path | path; a pad name or v marks a point on that pad's centre or on a via)
3.3V  (via drill 0.3)
  Top 0.152: PWR.A 14.62,29.38 14.75,29.25 GPS.A | GPS.A RX.A 14.75,16 | 14.75,16 TX.A | C2.P$1 31.2,25 | 32.25,24.65 32,24.9 31.3,24.9 31.2,25 | U4.5 32.25,24.65 | 32.25,24.65 32.5,24.9 33.5,24.9 34.25,24.15 U4.1 | U2.20 24.93,20.93 v25,21 27.72,23.72 27.72,24.24 28.48,25 31.2,25 | v28,16.2 28.1,16.2 | 28.1,16.2 C7.P$1 29.5,16.2 29.7,16.4 | U4.17 30.75,17.45 29.7,16.4 | 29.7,16.4 30.65,15.45 36.3,15.45 36.7,15.05 U1.8 v36.7,10.3 | 28.1,16.2 27.9,16 27.9,12.8 28.51,12.19 28.51,11.12 28.5,11.12 SILENT.1 28.45,9.2 R9.P$2 | GPS.A 16.6,23.5 v18.2,21.9 | U6.2 3.77,19.27 | 3.77,19.27 4.05,19 C1.P$1 6.47,18.33 6.47,16.91 6.79,16.58 8.24,16.58 8.82,16 14.75,16 | v3.8,18.1 3.77,18.12 3.77,19.27 | v44.2,8.2 SW1.2
  Bottom 0.152: v28,16.2 27.2,16.2 27,16.4 27,19 v25,21 22.4,21 21.5,21.9 v18.2,21.9 | v44.2,8.2 38.3,8.2 36.7,9.8 v36.7,10.3 | TP6.TP 4.5,17.4 v3.8,18.1
5V  (via drill 0.3)
  Top 0.152: IC2.5 3.35,26.95 C10.P$1 | C10.P$1 3.3,24.1 C3.P$1 U6.3 | C10.P$1 4,26.2 v4.8,26.2 5.4,25.6 13.28,25.6 v13.88,26.2 | v15.6,26.1 17.8,26.1 | 17.8,26.1 21.7,26.1 22.14,25.66 U3.3 | C6.P$1 17.8,26.1
  Bottom 0.152: v13.88,26.2 15.5,26.2 v15.6,26.1 | TP7.TP 4.8,25.5 v4.8,26.2
12V  (via drill 0.3)
  Top 0.406: J4.2 32.67,33.19 v33.5,33.19 35.71,33.19 D1.A 36.2,32.7 36.2,28.4 35.05,27.25 ON_OFF.3 35.85,24.9 R1.P$2 40.95,24.9 Q3.2
  Bottom 0.406: TP1.TP 33.1,32.79 v33.5,33.19
AIS_RX_EVENT  (via drill 0.3)
  Top 0.152: v14.9,33.6 14.9,30.98 14.4,30.48 13.9,30.48 13.77,30.34 13.77,29.37 12.88,28.48 v8.8,28.48 | v7.3,19.2 7.3,17.6 R4.P$2
  Bottom 0.152: J2.P$6 15.03,33.73 v14.9,33.6 | v8.8,28.48 8.8,20.7 v7.3,19.2
AIS_TX_EVENT  (via drill 0.3)
  Top 0.152: v15.8,33.6 15.6,33.4 v15.6,30.8 | R5.P$2 7.3,11.6 7.3,13.7 7.6,14 v13.88,14
  Bottom 0.152: J2.P$7 16.05,33.85 v15.8,33.6 | v13.88,14 15.4,14 16.5,15.1 16.5,29.9 v15.6,30.8
BOOT0  (via drill 0.3)
  Top 0.152: U4.31 36.45,21.95 38,20.4 R12.P$1 v38.1,18.5 41.4,18.5 42.56,17.34 42.56,10.18 42.8,9.94 SW1.3 42.1,8.73 41.8,8.73 41.67,8.6 41.67,7.8 41.8,7.67 42.1,7.67 SW1.1
  Bottom 0.152: TP5.TP v38.1,18.5
CAN_H  (via drill 0.3)
  Top 0.152: v20.8,27.5 20.8,28.9 20.81,28.91
  Top 0.254: J4.4 34,38.77 32.75,40.02 27.02,40.02 25.77,38.77 24.5,38.77 21.35,35.62 D3.2 21.35,32.35 20.8,31.8 20.8,28.93 20.81,28.91 U3.7
  Bottom 0.152: TP3.TP 20.8,26.9 v20.8,27.5
CAN_L  (via drill 0.3)
  Top 0.152: v22.1,27.5 22.1,28.83 U3.6
  Top 0.254: J4.5 27.87,37 25.84,34.97 23.67,34.97 22.65,33.95 D3.1 22.65,30.25 22.14,29.73 U3.6
  Bottom 0.152: TP4.TP 22.1,27.2 v22.1,27.5
CH340_RX  (via drill 0.3)
  Top 0.152: U$1.7 36.65,3.4 v35.1,3.4 | U1.2 v37.97,6.6
  Bottom 0.152: v35.1,3.4 35,3.5 35,5.8 35.8,6.6 v37.97,6.6
CH340_TX
  Top 0.152: U$1.6 38.21,2.06 38.51,1.77 39.93,1.77 40,1.7 40,3.68 39.67,4 39.67,5.16 39.23,5.6 U1.3
D+
  Top 0.152: J3.3 22.9,5.5 D4.C 23.5,5.9 24.3,5.1 24.5,5.1 29,5.1 29.5,4.6 U$1.1
D-  (via drill 0.3)
  Top 0.152: J3.2 22.25,5.75 D5.C 22.63,6.43 27.57,6.43 v28.2,5.8 | v29.9,3.51 30.07,3.33 U$1.2
  Bottom 0.152: v28.2,5.8 28.2,5.21 v29.9,3.51
GND  (via drill 0.3)
  Top 0.152: SW1.S1 44.75,6.64 45.28,7.17 45.28,9.23 44.75,9.76 SW1.S2
  other vias: 4,8 8,16 32,44 36,44 28,44 36,40 44,36 4,16 4,12 12,20 4,36 4,40 36,36 31.9,9 19.2,14.4 31.8,21.5 33.3,21.5 33.3,20 31.8,20 32.5,20.7 16.7,30.8 21.5,30.3 44.6,12.8 44.7,19.6 24.4,23.6 20.3,22.6 21.1,22.6 2.4,30.5 1.6,25.2 30,26.7 29.2,17.7 28.7,13.3 29.3,11.6 21.3,10.1 16.5,14.1
  pour Top: -2,47 48,47 48,7.7 -2,7.7
  pour Bottom: -3,48 49,48 49,7.6 -3,7.6
GND-ISO  (via drill 0.3)
  other vias: 40.9,3.4 40.9,2.1 30.3,6.1 33.7,2.8 18.4,5.8 16.6,1 16.6,6.5 16.6,3.7 26.4,5.8 27.2,5.8 33.9,5.4 38.9,3.7 38.8,4.7
  pour Top: 16,7 41.5,7 41.5,-0.5 16,-0.5
  pour Bottom: 16,7 41.5,7 41.5,-0.5 16,-0.5
GPS_STATUS  (via drill 0.3)
  Top 0.152: v12.71,33.81 12.4,33.5 v11.1,33.5 | v7.2,24.6 R3.P$2
  Bottom 0.152: J2.P$4 12.99,34.09 v12.71,33.81 | v11.1,33.5 7.2,29.6 v7.2,24.6
MCU_UART_RX
  Top 0.152: U4.20 32.25,17.25 33,16.5 38.08,16.5 39.18,15.4 40.9,15.4 41.4,15.9 R11.P$1
MCU_UART_TX  (via drill 0.3)
  Top 0.152: U4.19 31.75,16.45 32.3,15.9 37.6,15.9 v37.8,15.7 | v38.9,16.5 39.2,16.2 R10.P$1
  Bottom 0.152: v37.8,15.7 38.6,16.5 v38.9,16.5
N$1
  Top 0.152: C4.P$1 32.6,5.4 33.3,4.7 36.62,4.7 U$1.8
N$2
  Top 0.152: PWR.C R2.P$1
N$3
  Top 0.152: R3.P$1 GPS.C
N$4
  Top 0.152: R4.P$1 RX.C
N$5
  Top 0.152: R6.P$2 19.03,28.3 U3.8
N$6
  Top 0.152: R5.P$1 TX.C
N$7
  Top 0.152: U3.4 23.41,22.08 21.6,20.27 U2.2
N$8
  Top 0.152: R1.P$1 38.4,27.5 41.6,27.5 Q4.3
  Top 0.406: Q4.3 42.95,26.35 Q3.1
N$10  (via drill 0.3)
  Top 0.406: v12,32 F1.1 | Q3.3 41.9,22.7 36.9,22.7 33.81,25.79 32.95,25.79 32.36,26.39 32.36,27.35 29,30.7 v29,31.8
  Bottom 0.406: v12,32 12.19,31.81 14.49,31.81 14.5,31.8 v29,31.8
N$11
  Top 0.152: U2.1 19.59,22.44 U3.1
N$12
  Top 0.152: IC2.3 1.45,33.45 R8.P$1 C14.P$1
N$14
  Top 0.152: C9.P$1 20.4,13 Y1.3 20.25,15.72 U2.9
N$16
  Top 0.152: Y1.1 18.4,11.7 18.1,11.7 | 18.1,11.7 17.42,12.38 17.42,13.68 17.2,13.9 17.2,15.91 17.69,16.41 18.05,16.41 U2.8 | C8.P$1 17,11.7 18.1,11.7
NMEA_RX  (via drill 0.3)
  Top 0.152: R9.P$1 23.8,9.8 24.7,10.7 Q1.3 26.07,12.07 26.34,12.07 26.48,12.21 26.48,13.3 v27.07,13.89 | U4.9 29.05,22.45 v29,22.5
  Bottom 0.152: v29,22.5 28.5,22.5 27.1,21.1 27.1,19.33 27.3,19.13 27.3,18.09 28.58,16.82 28.58,15.28 27.19,13.89 v27.07,13.89
NMEA_RX_EN  (via drill 0.3)
  Top 0.152: Q1.1 25.75,13.9 26.75,14.9 R7.P$2 26.9,15.72 v26.42,16.2 | U4.14 27.75,19.95 26.4,18.6 v26.4,17.61
  Bottom 0.152: v26.4,17.61 26.42,17.59 v26.42,16.2
NRST  (via drill 0.3)
  Top 0.152: U4.4 32.75,24.04 v32.86,24.14 | U2.19 23.96,20.32 25.14,20.32 28.8,23.98 v28.8,24
  Bottom 0.152: v32.86,24.14 28.94,24.14 28.85,24.05 | 28.85,24.05 v28.8,24 | TP10.TP 26.85,24.05 28.85,24.05
PWR_CTRL  (via drill 0.3)
  Top 0.152: ON_OFF.2 33.23,31.75 v34.3,30.68 | v38.9,29.6 39.5,29 Q4.1
  Bottom 0.152: v34.3,30.68 34.58,30.41 34.78,30.41 35.58,29.6 v38.9,29.6
SPI_CS
  Top 0.152: U2.18 25.12,19.62 28.73,23.23 30.72,23.23 U4.8
SPI_MISO
  Top 0.152: U2.17 25.27,18.98 27.25,20.95 U4.12
SPI_MOSI
  Top 0.152: U2.16 25.43,18.32 27.55,20.45 U4.13
SPI_SCK  (via drill 0.3)
  Top 0.152: U4.11 28.75,21.45 v28.6,21.6 | U2.14 27.12,17.02 27.9,17.8 v27.9,19.1
  Bottom 0.152: v28.6,21.6 27.9,20.9 v27.9,19.1
SWCLK  (via drill 0.3)
  Top 0.152: U4.24 35.6,18.2 v35.8,18
  Bottom 0.152: v35.8,18 35.8,17.4 36.8,16.4 TP12.TP
SWDIO  (via drill 0.3)
  Top 0.152: U4.23 v33.75,17.36 v33.76,17.36
  Bottom 0.152: v33.76,17.36 34,17.11 TP11.TP
TRANSPONDER_UART_RX  (via drill 0.3)
  Top 0.152: R11.P$2 41.3,14.6 39.23,12.54 U1.6 39.2,11.66 v39.2,9.9 | D6.C 11.47,26.7 v11.37,26.8
  Bottom 0.152: J2.P$3 11.97,32.79 11.37,32.19 v11.37,26.8 11.37,21.3 | 11.37,21.3 11.37,10.93 13.02,9.28 20.14,9.28 20.22,9.2 31.28,9.2 32.67,10.59 34.78,10.59 35.31,11.12 35.31,11.4 38.4,11.4 39.2,10.6 v39.2,9.9 | TP8.TP 11.57,21.5 11.37,21.3
TRANSPONDER_UART_TX  (via drill 0.3)
  Top 0.152: U1.7 37.97,14.06 38,14.1 | R10.P$2 38.5,14.6 38,14.1 | 38,14.1 37.6,14.5 v37.6,14.8 | v12.9,30.8 13.3,31.2 v13.3,33 14.48,34.18 16.04,34.18 16.72,33.5 D7.C 18.8,33.6 v19.9,33.6 | v25.4,30.7 25,31.1 v25,33.2 | R7.P$1 23.9,13.5 23.9,13.05 Q1.2 24.24,13 v24.74,12.5
  Bottom 0.152: v37.6,14.8 36.8,14 28,14 26.5,12.5 v24.74,12.5 14.6,12.5 13.68,13.42 13.64,13.42 13.3,13.76 13.3,21.57 12.9,21.97 v12.9,30.8 | J2.P$5 14.01,33.71 v13.3,33 | TP9.TP v25.4,30.7 | v25,33.2 24.6,33.6 v19.9,33.6
TX_DISABLE  (via drill 0.3)
  Top 0.152: v19.9,8.7 20.38,8.22 29.3,8.22 30.03,8.96 30.03,12.78 SILENT.2 v31,14.87 | v31,16.1 31,17.1 31.25,17.35 U4.18
  Bottom 0.152: J2.P$2 10.95,34.34 9.88,33.27 9.77,33.27 6.7,30.2 6.7,24.92 6.62,24.84 6.62,14.78 12.7,8.7 v19.9,8.7 | v31,14.87 v31,16.1
V_OUT  (via drill 0.3)
  Top 0.152: F1.2 IC2.1 | R8.P$2 C11.P$1 3.35,33.25 IC2.1 | IC2.1
  Top 0.406: F1.2 7.78,33.18 v7.9,33.3
  Bottom 0.406: v7.9,33.3 8.3,33.7 9.3,33.7 9.93,34.33 J2.P$1
VBUS  (via drill 0.3)
  Top 0.152: J3.1 21.6,3.2 21.8,3 26.6,3 28.75,0.85 | v29.2,0.73 28.86,0.73 28.75,0.85 | C5.P$1 38.99,0.8 U$1.5 v34.8,0.8 34.8,2.88 34.52,3.16 34.52,3.64 34.86,3.98 37.83,3.98 38.05,4.21 38.05,5 37.92,5.14 36.66,5.14 C13.P$2 35.7,6.5 U1.1 | D2.C 28.75,0.85
  Bottom 0.152: v29.2,0.73 34.73,0.73 v34.8,0.8

### Text on the board
tNames: MAIANA NMEA2000 Breakout / Rev 7.0 (ISO)